# EAGLE design main (EAGLE 6.6.0)
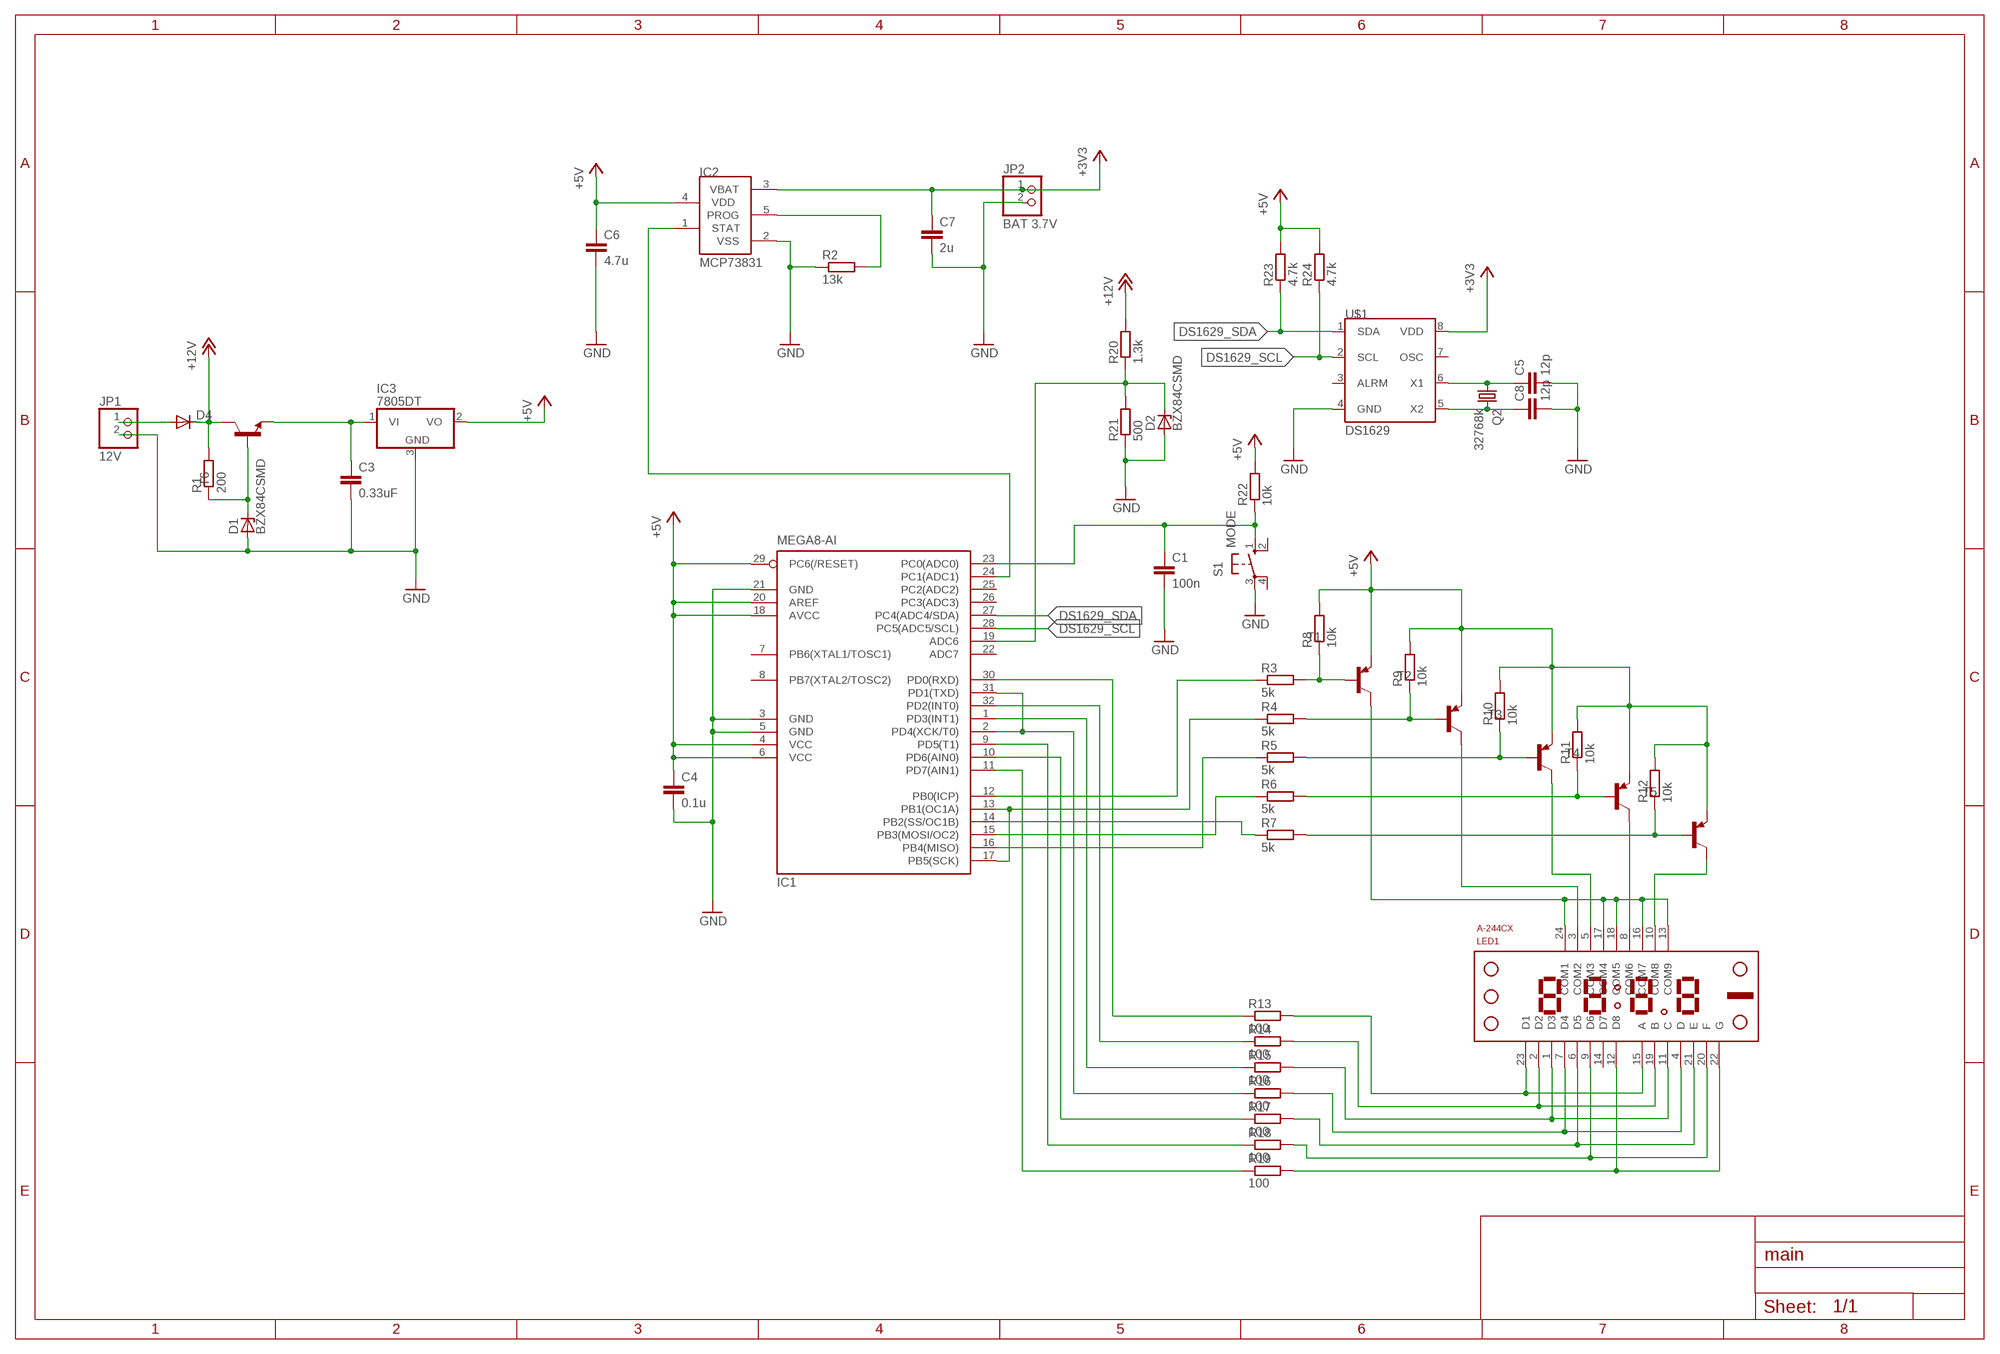
[diagram p0: schematic, sheet 1]

## Parts
C1  100n  C-EUC0805  [C0805]
C3  0.33uF  C-EUC1206  [C1206]
C4  0.1u  C-EUC0805  [C0805]
C5  12p  C-EUC0805  [C0805]
C6  4.7u  C-EUC1206  [C1206]
C7  2u  C-EUC1206  [C1206]
C8  12p  C-EUC0805  [C0805]
D1  BZX84CSMD  [TO236]
D2  BZX84CSMD  [TO236]
D4  DIODE-D-7.5  [D-7.5]
IC1  MEGA8-AI  [TQFP32-08]
IC2  MCP73831  [SOT23-5L]
IC3  7805DT  [TO252]
JP1  12V  PINHD-1X2  [1X02]
JP2  BAT 3.7V  PINHD-1X2  [1X02]
LED1  A-244CX  [C/A-244CX]
Q2  32768k  CRYSTALTC26H  [TC26H]
R1  200  R-EU_M0805  [M0805]
R2  13k  R-EU_M0805  [M0805]
R3  5k  R-EU_M0805  [M0805]
R4  5k  R-EU_M0805  [M0805]
R5  5k  R-EU_M0805  [M0805]
R6  5k  R-EU_M0805  [M0805]
R7  5k  R-EU_M0805  [M0805]
R8  10k  R-EU_M0805  [M0805]
R9  10k  R-EU_M0805  [M0805]
R10  10k  R-EU_M0805  [M0805]
R11  10k  R-EU_M0805  [M0805]
R12  10k  R-EU_M0805  [M0805]
R13  100  R-EU_M0805  [M0805]
R14  100  R-EU_M0805  [M0805]
R15  100  R-EU_M0805  [M0805]
R16  100  R-EU_M0805  [M0805]
R17  100  R-EU_M0805  [M0805]
R18  100  R-EU_M0805  [M0805]
R19  100  R-EU_M0805  [M0805]
R20  1.3k  R-EU_M0805  [M0805]
R21  500  R-EU_M0805  [M0805]
R22  10k  R-EU_M0805  [M0805]
R23  4.7k  R-EU_M0805  [M0805]
R24  4.7k  R-EU_M0805  [M0805]
S1  MODE  10-XX  [B3F-10XX]
T1  BC807-25-PNP-SOT23-BEC  [SOT23-BEC]
T2  BC807-25-PNP-SOT23-BEC  [SOT23-BEC]
T3  BC807-25-PNP-SOT23-BEC  [SOT23-BEC]
T4  BC807-25-PNP-SOT23-BEC  [SOT23-BEC]
T5  BC807-25-PNP-SOT23-BEC  [SOT23-BEC]
T6  -NPN-SOT23-EBC  [SOT23-EBC]
U$1  DS1629  [SOIC-8]

## Nets
+5V: C4.1 C6.1 IC1.4(VCC) IC1.6(VCC) IC1.18(AVCC) IC1.20(AREF) IC1.29(PC6(/RESET)) IC2.4(VDD) IC3.2(VO) R8.2 R9.2 R10.2 R11.2 R12.2 R22.2 R23.2 R24.2 T1.E T2.E T3.E T4.E T5.E
+12V: D4.C R1.2 R20.2 T6.C
DS1629_SCL: IC1.28(PC5(ADC5/SCL)) R24.1 U$1.2(SCL)
DS1629_SDA: IC1.27(PC4(ADC4/SDA)) R23.1 U$1.1(SDA)
GND: C1.2 C3.2 C4.2 C5.2 C6.2 C7.2 C8.2 D1.A D2.A IC1.3(GND) IC1.5(GND) IC1.21(GND) IC2.2(VSS) IC3.3(GND) JP1.2 JP2.2 R2.1 R21.1 S1.3(P) U$1.4(GND)
N$1: LED1.2(D2) LED1.19(B) R14.2
N$2: LED1.4(D) LED1.7(D4) R16.2
N$3: D2.C IC1.19(ADC6) R20.1 R21.2
N$4: IC1.24(PC1(ADC1)) IC2.1(STAT)
N$5: D4.A JP1.1
N$6: D1.C R1.1 T6.B
N$7: C3.1 IC3.1(VI) T6.E
N$8: IC2.5(PROG) R2.2
N$9: LED1.8(COM6) T4.C
N$10: LED1.5(COM3) T3.C
N$11: LED1.3(COM2) T2.C
N$12: LED1.13(COM9) LED1.16(COM7) LED1.17(COM4) LED1.18(COM5) LED1.24(COM1) T1.C
N$13: R3.2 R8.1 T1.B
N$14: R4.2 R9.1 T2.B
N$15: R5.2 R10.1 T3.B
N$16: R6.2 R11.1 T4.B
N$17: R7.2 R12.1 T5.B
N$18: LED1.1(D3) LED1.11(C) R15.2
N$19: IC1.10(PD6(AIN0)) R17.1
N$20: IC1.30(PD0(RXD)) R13.1
N$21: IC1.32(PD2(INT0)) R14.1
N$22: IC1.1(PD3(INT1)) R15.1
N$23: IC1.12(PB0(ICP)) R3.1
N$24: IC1.13(PB1(OC1A)) IC1.17(PB5(SCK)) R4.1
N$25: IC1.16(PB4(MISO)) R5.1
N$26: IC1.15(PB3(MOSI/OC2)) R6.1
N$27: IC1.14(PB2(SS/OC1B)) R7.1
N$28: C5.1 Q2.1 U$1.6(X1)
N$29: C8.1 Q2.2 U$1.5(X2)
N$30: IC1.2(PD4(XCK/T0)) IC1.31(PD1(TXD)) R16.1
N$31: LED1.6(D5) LED1.21(E) R17.2
N$32: LED1.9(D6) LED1.20(F) R18.2
N$33: LED1.12(D8) LED1.22(G) R19.2
N$34: LED1.15(A) LED1.23(D1) R13.2
N$35: IC1.9(PD5(T1)) R18.1
N$36: IC1.11(PD7(AIN1)) R19.1
N$37: LED1.10(COM8) T5.C
N$38: C1.1 IC1.23(PC0(ADC0)) R22.1 S1.1(S)
VDD: C7.1 IC2.3(VBAT) JP2.1 U$1.8(VDD) ; supply symbol labelled +3V3
Unconnected: IC1.7(PB6(XTAL1/TOSC1)) IC1.8(PB7(XTAL2/TOSC2)) IC1.22(ADC7) IC1.25(PC2(ADC2)) IC1.26(PC3(ADC3)) LED1.14(D7) S1.2(S1) S1.4(P1) U$1.3(ALRM) U$1.7(OSC)

## Library data of the parts
C1 C3-C8 = rcl:C-EU: CAPACITOR, European symbol
D1 D2 = diode:BZX84CSMD: Z DIODE
D4 = diode:DIODE-: DIODE
IC1 = atmel:MEGA8: MICROCONTROLLER 8 Kbytes FLASH, 1 kbytes SRAM, 512 bytes EEPROM, USART, 6-channel 10 bit ADC, 2-channel 8 bit ADC Pin compatible with Atmega48, ATMega88, ATMega168 Source: avr.lbr; MPN: ATMEGA8-16AU; OC_FARNELL: 9171371; OC_NEWARK: 73M8863
IC2 = microchip-update-2:MCP73831: Miniature Single-Cell, Fully Integrated Li-Ion, Li-Polymer Charge Management Controllers
IC3 = linear:78*: Positive VOLTAGE REGULATOR Source: http://cache.national.com/ds/LM/LM78L05.pdf http://www.fairchildsemi.com/ds/LM/LM7805.pdf
JP1 JP2 = pinhead:PINHD-1X2: PIN HEADER
LED1 = paralight:A-244CX
Q2 = crystal:CRYSTAL: CRYSTAL; OC_FARNELL: unknown; OC_NEWARK: unknown
R1-R24 = rcl:R-EU_: RESISTOR, European symbol
S1 = switch-omron:10-XX: OMRON SWITCH; MPN: B3F-1000; OC_FARNELL: 176432; OC_NEWARK: 36M3542
T1-T5 = transistor:*-PNP-: PNP Transistror
T6 = transistor:*-NPN-: NPN Transistror BF959 corrected 2008.03.06
U$1 = dallas-1:DS1629: I2C Serial RTC with 32 bytes SRAM and thermometer from -55°C to +125°C

## Board
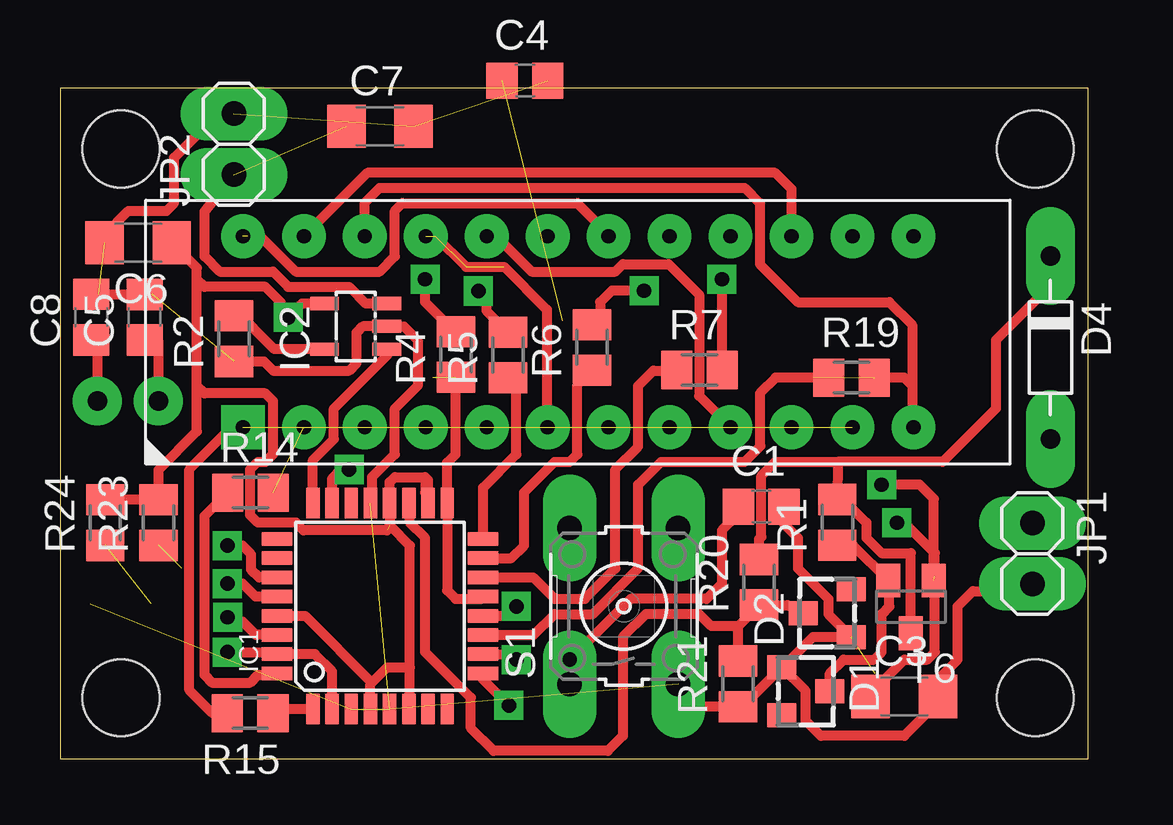
[diagram p1: board, top side]
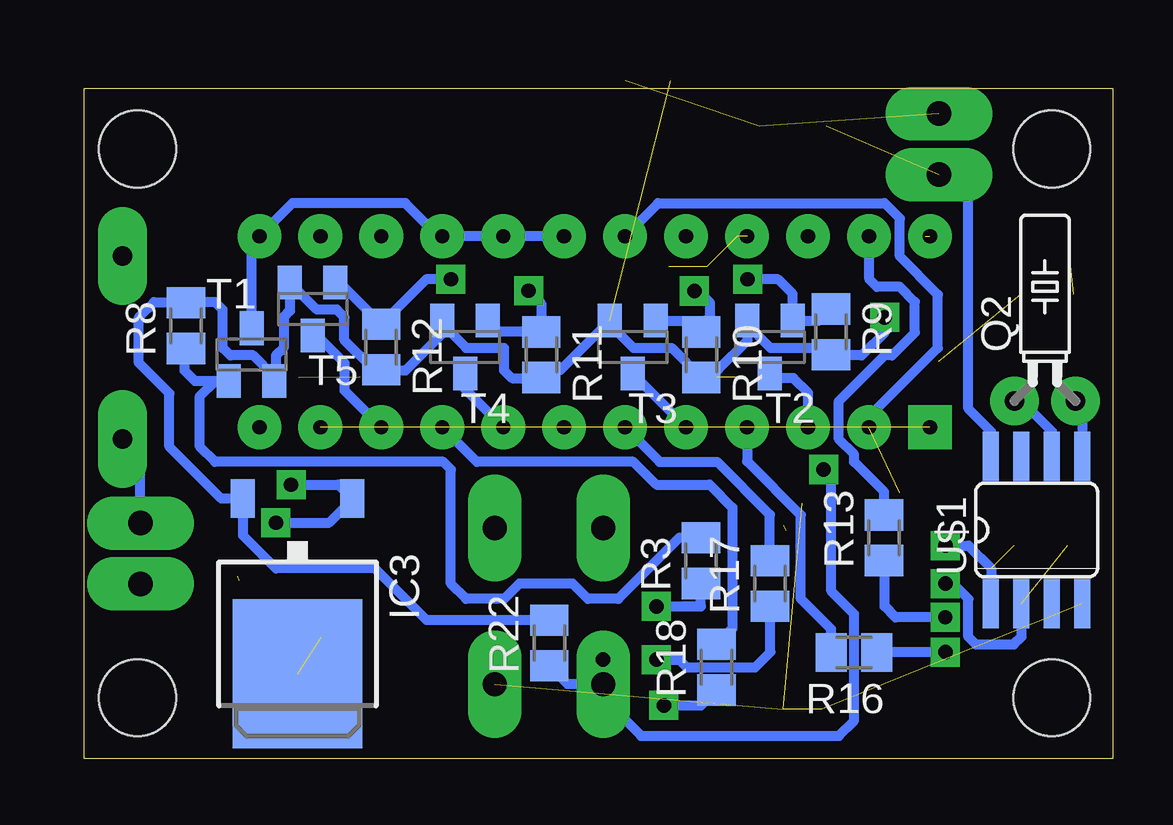
[diagram p2: board, bottom side, seen from below]

Size 42.85 x 27.93 mm. Coordinates in mm from the lower left corner, seen from the top.
Outline: 0,0 42.85,0 42.85,27.93 0,27.93 0,0
Copper layers (1*16): Top 0.035mm / dielectric 1.5mm / Bottom 0.035mm
Design rules "default": minimum track width 20mil, minimum drill 20mil, track to track 12mil, track to pad 12mil, pad to pad 12mil, via to via 12mil, smd to smd 8mil, copper to edge 40mil, drill to drill 40mil, minimum pad ring 24mil, minimum via ring 12mil, stop-mask expansion 4mil, vias tented up to drill 0mil, thermal gap 20mil
Holes 3.2 mm at 2.54,2.54 40.64,2.54 40.64,25.4 2.54,25.4

### Footprints (pad centres in the part's own frame; a part is rotated, then mirrored left to right if it is on the bottom)
C0805 = smd 1.3 x 1.5: 1 -0.95,0; 2 0.95,0
C1206 = smd 1.6 x 1.8: 1 -1.4,0; 2 1.4,0
TO236 = smd 1 x 1.2: A -1,-1; C 0,1; NC 1,-1
D-7.5 = drill 0.813 long: A 3.81,0; C -3.81,0
TQFP32-08 = smd 1.27 x 0.559: 1 -4.293,2.8; 2 -4.293,2; 3 -4.293,1.2; 4 -4.293,0.4; 5 -4.293,-0.4; 6 -4.293,-1.2; 7 -4.293,-2; 8 -4.293,-2.8; 17 4.293,-2.8; 18 4.293,-2; 19 4.293,-1.2; 20 4.293,-0.4; 21 4.293,0.4; 22 4.293,1.2; 23 4.293,2; 24 4.293,2.8 | smd 0.559 x 1.27: 9 -2.8,-4.293; 10 -2,-4.293; 11 -1.2,-4.293; 12 -0.4,-4.293; 13 0.4,-4.293; 14 1.2,-4.293; 15 2,-4.293; 16 2.8,-4.293; 25 2.8,4.293; 26 2,4.293; 27 1.2,4.293; 28 0.4,4.293; 29 -0.4,4.293; 30 -1.2,4.293; 31 -2,4.293; 32 -2.8,4.293
SOT23-5L = smd 0.55 x 1.2: 1 -0.95,-1.3; 2 0,-1.3; 3 0.95,-1.3; 4 0.95,1.3; 5 -0.95,1.3
TO252 = smd 1 x 1.6: 1 -2.28,-4.8; 2 2.28,-4.8 | smd 5.4 x 6.2: 3 0,2.5
1X02 = drill 1.016 long: 1 -1.27,0; 2 1.27,0
C/A-244CX = drill 0.6 pad 1.27 square: 1 -13.97,-3.975 | drill 0.6 pad 1.27: 2 -11.43,-3.975; 3 -8.89,-3.975; 4 -6.35,-3.975; 5 -3.81,-3.975; 6 -1.27,-3.975; 7 1.27,-3.975; 8 3.81,-3.975; 9 6.35,-3.975; 10 8.89,-3.975; 11 11.43,-3.975; 12 13.97,-3.975; 13 13.97,3.985; 14 11.43,3.985; 15 8.89,3.985; 16 6.35,3.985; 17 3.81,3.985; 18 1.27,3.985; 19 -1.27,3.985; 20 -3.81,3.985; 21 -6.35,3.985; 22 -8.89,3.985; 23 -11.43,3.985; 24 -13.97,3.985
TC26H = drill 0.813: 1 -1.27,0; 2 1.27,0
M0805 = smd 1.3 x 1.6: 1 -0.95,0; 2 0.95,0
B3F-10XX = drill 1.016 long: 1 -3.251,2.261; 2 3.251,2.261; 3 -3.251,-2.261; 4 3.251,-2.261
SOT23-BEC = smd 1 x 1.4: B -0.95,-1.1; C 0,1.1; E 0.95,-1.1
SOT23-EBC = smd 1 x 1.4: B 0.95,-1.1; C 0,1.1; E -0.95,-1.1
SOIC-8 = smd 2.032 x 0.66: 1 -3.073,1.27; 2 -3.073,0; 3 -3.073,-1.27; 4 -3.073,-2.54; 5 3.073,-2.54; 6 3.073,-1.27; 7 3.073,0; 8 3.073,1.27

### Placement (x,y rotation side)
C1  29.22,10.5 0 top
C3  35.18,2.59 0 top
C4  19.37,28.25 0 top
C5  3.52,18.39 90 top
C6  3.26,21.5 180 top
C7  13.33,26.35 0 top
C8  1.3,18.39 90 top
D1  31.08,2.81 270 top
D2  31.97,6.06 90 top
D4  41.27,17.13 270 top
IC1  13.34,6.35 90 top
IC2  12.32,18.01 90 top
IC3  33.97,6.03 180 bottom
JP1  40.51,8.54 270 top
JP2  7.25,25.6 90 top
LED1  21.59,17.78 0 top
Q2  2.83,14.9 0 bottom
R1  32.39,9.84 90 top
R2  7.25,17.5 90 top
R3  17.15,8.25 90 bottom
R4  16.49,16.84 90 top
R5  18.67,16.82 90 top
R6  22.16,17.13 90 top
R7  26.64,16.19 0 top
R8  38.61,18.04 90 bottom
R9  11.75,17.78 270 bottom
R10  17.15,16.83 270 bottom
R11  23.81,16.83 270 bottom
R12  30.48,17.15 270 bottom
R13  9.53,9.2 90 bottom
R14  7.94,11.08 0 top
R15  7.92,1.89 180 top
R16  10.78,4.42 180 bottom
R17  14.29,7.29 90 bottom
R18  16.51,3.81 90 bottom
R19  32.98,15.87 0 top
R20  29.13,7.35 90 top
R21  28.25,3.12 90 top
R22  23.48,4.82 90 bottom
R23  4.11,9.83 90 top
R24  1.89,9.83 90 top
S1  23.49,6.35 90 top
T1  35.88,16.83 0 bottom
T2  14.29,17.15 180 bottom
T3  20,17.15 180 bottom
T4  26.99,17.15 180 bottom
T5  33.34,18.73 180 bottom
T6  35.46,6.32 180 top
U$1  3.81,9.53 90 bottom

### Tracks (layer width: path | path; a pad name or v marks a point on that pad's centre or on a via)
+5V  (via drill 0.6)  (2 unrouted)
  Top 0.406: IC1.6 14.54,2.17 14.58,2.22 14.58,3.8 | 14.58,3.8 14.58,8.88 13.73,9.72 IC1.20 13.73,11.52 13.95,11.73 15.22,11.73 | IC1.18 15.34,11.61 15.22,11.73 | IC1.4 12.94,3.11 13,3.17 | 13,3.17 13.63,3.8 14.58,3.8 | IC1.29 10.22,5.95 13,3.17 | R24.2 R23.2 4.11,12.03 5.71,13.63 5.71,15.53 | IC2.4 10.08,18.96 v9.51,18.39 9.19,18.7 9.19,19.02 8.56,19.65 6.02,19.65 5.71,19.97 | 15.22,11.73 15.22,11.1 | 13.63,9.51 10.14,9.51 9.83,9.83 8.24,9.83 7.92,10.14 7.92,12.05 8.24,12.36 8.56,12.36 8.88,12.68 8.88,14.9 8.56,15.22 6.02,15.22 5.71,15.53 | 5.71,15.53 5.71,19.97 | 5.71,19.97 5.71,20.45 C6.1
  Bottom 0.406: v9.51,18.39 9.51,17.75 10.46,16.8 11.72,16.8 R9.2 12.04,17.12 14.27,17.12 15.24,18.09 T2.E 15.22,18.22 15.22,17.43 16.45,16.2 R10.2 18.39,17.12 19.97,17.12 20.95,18.1 T3.E 23,16.2 R11.2 23.84,15.85 25.04,15.85 25.37,16.18 25.37,17.12 26.95,17.12 27.94,18.11 T4.E 27.94,17.71 29.48,16.17 30.45,16.17 R12.2 30.78,16.2 32.02,17.43 32.02,18.39 32.33,18.7 33.16,18.7 T5.E 34.29,18.65 34.55,18.39 34.55,17.12 34.87,16.8 34.87,15.79 T1.E 34.93,15.91 35.82,16.8 36.77,16.8 37.09,17.12 37.09,18.7 37.41,19.02 38.58,19.02 R8.2 38.64,19.02 39.94,19.02 40.58,18.39 40.58,16.48 39.31,15.22 39.31,13 37.14,10.83 IC3.2 36.25,9.3 34.87,7.92 30.75,7.92 28.59,5.77 R22.2
+12V
  Top 0.406: R20.2 29.13,9.16 29.22,9.24 29.22,11.78 29.8,12.36 32.4,12.36 | 32.4,12.36 R1.2 32.64,10.79 33.6,9.83 33.6,9.19 34.24,8.56 35.46,8.56 T6.C | D4.C 41.27,19.71 38.99,17.43 38.99,14.58 36.77,12.36 32.4,12.36
DS1629_SCL  (via drill 0.6)  (1 unrouted)
  Top 0.406: v6.97,7.29 7.61,7.29 8.15,6.75 IC1.28
  Bottom 0.406: U$1.2 3.8,5.07 4.12,4.75 5.71,4.75 6.02,5.07 6.02,6.66 6.66,7.29 v6.97,7.29
DS1629_SDA  (via drill 0.6)  (1 unrouted)
  Top 0.406: IC1.27 8.3,7.55 7.96,7.88 7.96,8.51 7.61,8.88 v6.97,8.88
  Bottom 0.406: v6.97,8.88 6.02,8.88 5.07,7.92 U$1.1
GND  (9 unrouted)
  Top 0.406: 1.62,19.34 C8.2 3.84,19.34 C5.2 | S1.3 26.69,2.17 R21.1 28.43,2.17 D1.A | C1.2 30.17,9.77 30.75,9.19 30.75,7.92 32.02,6.66 32.02,6.02 D2.A 32.96,5.07 31.38,5.07 30.12,3.81 D1.A | D1.A 31.07,2.82 31.07,1.58 31.7,0.95 35.19,0.95 36.58,2.34 C3.2 36.58,3.29 37.41,4.12 37.41,6.34 38.04,6.97 40.5,6.97 JP1.2 | IC1.21 13,10.71 13,11.73 13.95,12.68 13.95,14.58 14.9,15.53 14.9,17.43 14.32,18.01 IC2.2 12.62,18.01 12.36,17.75 12.36,16.48 12.05,16.17 8.88,16.17 8.5,16.55 R2.1 | C6.2 1.86,21.83 2.85,22.82 4.44,22.82 4.75,23.14 4.75,25.04 6.66,26.95 7.49,26.95 JP2.2
  Bottom 0.406: IC3.3 33.97,3.22 33.28,2.54
N$1  (1 unrouted)
  Bottom 0.406: LED1.19 18.94,23.14 9.51,23.14 8.88,22.51 8.88,20.92 7.29,19.34 7.29,17.12 10.16,14.25 LED1.2
N$2  (1 unrouted)
  Bottom 0.406: LED1.4 15.24,12.39 13,10.14 13,6.66 11.73,5.39 R16.2
N$3
  Top 0.406: R21.2 28.25,5.51 | 28.25,5.51 R20.1 30.32,6.4 D2.C | 28.25,5.51 27.14,5.51 26.63,6.02 24.41,6.02 23.46,5.07 23.46,0.95 22.82,0.32 18.07,0.32 17.12,1.27 17.12,2.54 15.22,4.44 15.22,9.19 14.58,9.83 14.58,10.6 IC1.19
N$4
  Top 0.406: IC1.24 10.54,12.44 11.41,13.31 11.41,14.58 13.62,16.79 IC2.1
N$5
  Bottom 0.406: JP1.1 40.51,12.57 D4.A
N$6
  Top 0.406: D1.C 32.08,3.55 32.65,4.12 33.92,4.12 34.24,4.44 34.24,6.02 34.55,6.34 34.55,7.38 T6.B 33.04,8.89 R1.1
N$7  (via drill 0.6)  (1 unrouted)
  Top 0.406: C3.1 33.78,2.71 35.19,4.12 36.14,4.12 36.45,4.44 36.45,7.38 T6.E 36.41,10.82 35.82,11.41 v34.24,11.41 | 36.45,7.61 36.45,8.56 35.19,9.83 v34.87,9.83
  Bottom 0.406: 31.95,11.1 IC3.1 32.27,11.41 v34.24,11.41 | v34.87,9.83 32.65,9.83 32.02,10.46
N$8
  Top 0.406: IC2.5 8.94,17.06 7.23,18.76 R2.2
N$9
  Bottom 0.406: T4.C 26.99,15.39 LED1.8
N$10
  Bottom 0.406: T3.C 20,16.03 LED1.5
N$11
  Bottom 0.406: LED1.3 12.7,15.24 13.31,15.85 14.09,15.85 T2.C
N$12  (1 unrouted)
  Top 0.406: LED1.18 22.86,21.84 21.56,23.14 14.27,23.14 13.95,22.82 13.95,20.92 13.31,20.29 9.83,20.29 8.35,21.77 7.82,21.77
  Bottom 0.406: LED1.18 LED1.17 LED1.16 28.11,21.77 29.48,23.14 34.18,23.14 LED1.13 35.88,21.44 T1.C
N$13
  Bottom 0.406: T1.B 37.41,15.73 | 37.41,15.73 38.24,15.73 38.67,16.17 38.67,17.02 R8.1 | R3.2 18.07,9.2 20.61,6.66 21.87,6.66 22.51,7.29 24.73,7.29 25.36,6.66 26.95,6.66 27.58,7.29 27.58,12.05 27.9,12.36 37.41,12.36 38.04,13 38.04,15.1 37.41,15.73
N$14  (via drill 0.6)
  Top 0.406: v15.23,19.96 v15.22,19.97 15.22,19.02 16.45,17.79 R4.2
  Bottom 0.406: R9.1 12.23,18.25 T2.B 13.34,19.36 13.95,19.97 v15.22,19.97
N$15  (via drill 0.6)
  Top 0.406: v17.43,19.48 17.77,19.15 17.77,18.67 R5.2
  Bottom 0.406: T3.B 16.98,18.25 R10.1 16.8,18.12 16.8,19.02 17.25,19.47 v17.43,19.48
N$16  (via drill 0.6)
  Top 0.406: v24.34,19.49 23,19.5 22.51,19.02 22.51,18.11 R6.2
  Bottom 0.406: v24.34,19.49 23.82,18.96 R11.1 25.57,17.78 T4.B
N$17  (via drill 0.6)
  Top 0.406: R7.2 27.59,19.96 v27.58,19.97
  Bottom 0.406: T5.B 32.22,19.83 R12.1 28.61,19.97 v27.58,19.97
N$18  (1 unrouted)
  Top 0.406: R15.2 6.35,1.89 5.39,2.85 5.39,12.05 6.97,13.63 7.45,13.63 LED1.1
N$19  (via drill 0.6)
  Top 0.406: IC1.10 18.47,4.35 18.7,4.12 v19.02,4.12
  Bottom 0.406: v19.02,4.12 18.07,4.12 17.75,3.8 14.9,3.8 14.27,4.44 14.27,6.32 R17.1
N$20  (via drill 0.6)
  Top 0.406: IC1.30 8.16,5.15 7.61,5.71 7.17,5.71 v6.98,5.89
  Bottom 0.406: v6.98,5.89 9.06,5.89 9.51,6.34 9.51,8.24 R13.1
N$21
  Top 0.406: R14.1 6.02,10.11 6.02,3.49 6.34,3.17 7.92,3.17 8.24,3.49 8.98,3.49 IC1.32
N$22
  Top 0.406: IC1.1 9.04,2.06 R15.1
N$23  (via drill 0.6)
  Top 0.406: IC1.12 18.95,5.95 v19.02,6.34
  Bottom 0.406: v19.02,6.34 17.16,6.34 R3.1
N$24  (1 unrouted)
  Top 0.406: IC1.13 17.54,6.66 16.48,6.66 16.14,7.01 IC1.17 16.14,12.33 16.48,12.68 16.48,15.88 R4.1
N$25
  Top 0.406: IC1.16 17.63,11.29 19.02,12.68 19.02,15.52 R5.1
N$26
  Top 0.406: IC1.15 18.81,8.35 19.34,8.88 19.34,11.1 20.61,12.36 21.24,12.36 21.56,12.68 21.56,15.58 R6.1
N$27
  Top 0.406: IC1.14 19.71,7.55 20.61,6.66 21.87,6.66 23.14,7.92 23.14,12.05 24.09,13 24.09,15.53 24.73,16.17 25.67,16.17 R7.1
N$28
  Top 0.406: C5.1 4.1,17.38 Q2.1
  Bottom 0.406: Q2.1 3.81,14.9 2.54,13.63 U$1.6
N$29
  Top 0.406: C8.1 1.56,17.38 Q2.2
  Bottom 0.406: Q2.2 1.56,14.24 1.27,13.95 U$1.5
N$30  (via drill 0.6)
  Top 0.406: IC1.2 11.34,3.64 10.62,4.35 IC1.31 8.95,4.44 v6.97,4.44
  Bottom 0.406: v6.97,4.44 9.81,4.44 R16.1
N$31  (3 unrouted)
  Top 0.406: LED1.6 20.29,13.84 20.29,18.7 18.51,20.49 16.92,20.49 15.64,21.77 LED1.21
  Bottom 0.406: LED1.6 18.88,12.36 16.48,12.36 14.29,10.17 R17.2
N$32
  Top 0.406: 27.9,13.85 LED1.9 26.63,15.12 26.63,19.34 25.36,20.61 23.46,20.61 23.14,20.29 19.65,20.29 18.18,21.77 LED1.20
  Bottom 0.406: LED1.9 26.5,12.36 19.97,12.36 19.02,11.41 16.8,11.41 15.85,10.46 15.85,5.42 R18.2
N$33  (1 unrouted)
  Top 0.406: LED1.22 12.7,23.16 13.31,23.77 28.53,23.77 29.16,23.14 29.16,20.61 30.75,19.02 34.55,19.02 35.5,18.07 35.5,15.53 | 35.5,15.53 35.5,13.86 LED1.12 | 35.5,15.53 35.17,15.87 R19.2
N$34
  Top 0.406: LED1.15 30.48,23.73 29.8,24.41 12.8,24.41 LED1.23
  Bottom 0.406: R13.2 9.53,11.11 10.78,12.36 10.78,12.68 11.41,13.31 11.41,14.9 9.51,16.8 9.19,16.8 8.24,17.75 8.24,19.02 8.88,19.65 9.83,19.65 10.14,19.97 10.14,21.75 LED1.23
N$35  (via drill 0.6)
  Top 0.406: IC1.9 17.63,3.29 v18.7,2.22
  Bottom 0.406: v18.7,2.22 17.15,2.22 R18.1
N$36
  Top 0.406: IC1.11 19.73,5.15 20.61,6.02 22.19,6.02 24.09,7.92 24.09,11.41 25.04,12.36 28.53,12.36 29.19,13.02 29.16,13.04 29.16,15.22 29.82,15.87 R19.1
N$37
  Bottom 0.406: T5.C 33.16,17.63 32.02,16.48 32.02,15.34 LED1.10
N$38  (via drill 0.6)
  Top 0.406: C1.1 27.95,9.88 27.58,9.51 27.58,7.29 26.95,6.66 23.77,6.66 v21.24,4.12 S1.1 | v12.05,12.05 11.73,12.05 11.34,11.65 IC1.23
  Bottom 0.406: S1.1 22.71,3.1 R22.1 | v21.24,4.12 21.24,2.54 19.65,0.95 11.41,0.95 10.78,1.58 10.78,6.02 11.73,6.97 11.73,11.73 v12.05,12.05
VDD  (1 unrouted)
  Top 0.406: IC2.3 12.74,18.96 12.05,19.65 9.51,19.65 8.88,20.29 6.66,20.29 6.02,20.92 6.02,22.79 JP2.1
  Bottom 0.406: U$1.8 5.08,13.64 6.02,14.58 6.02,23.46 6.97,24.41 7.49,24.41 JP2.1